# EasyEDA schematic SCH_Controlador-de-Voo_2026-04-27.json
TITLE: Placa Controladora de Voo com Arduino Nano; REV: 1.0; Date: 2026-04-27; Sheet: 1/1; Company: Eliezer Carvalho
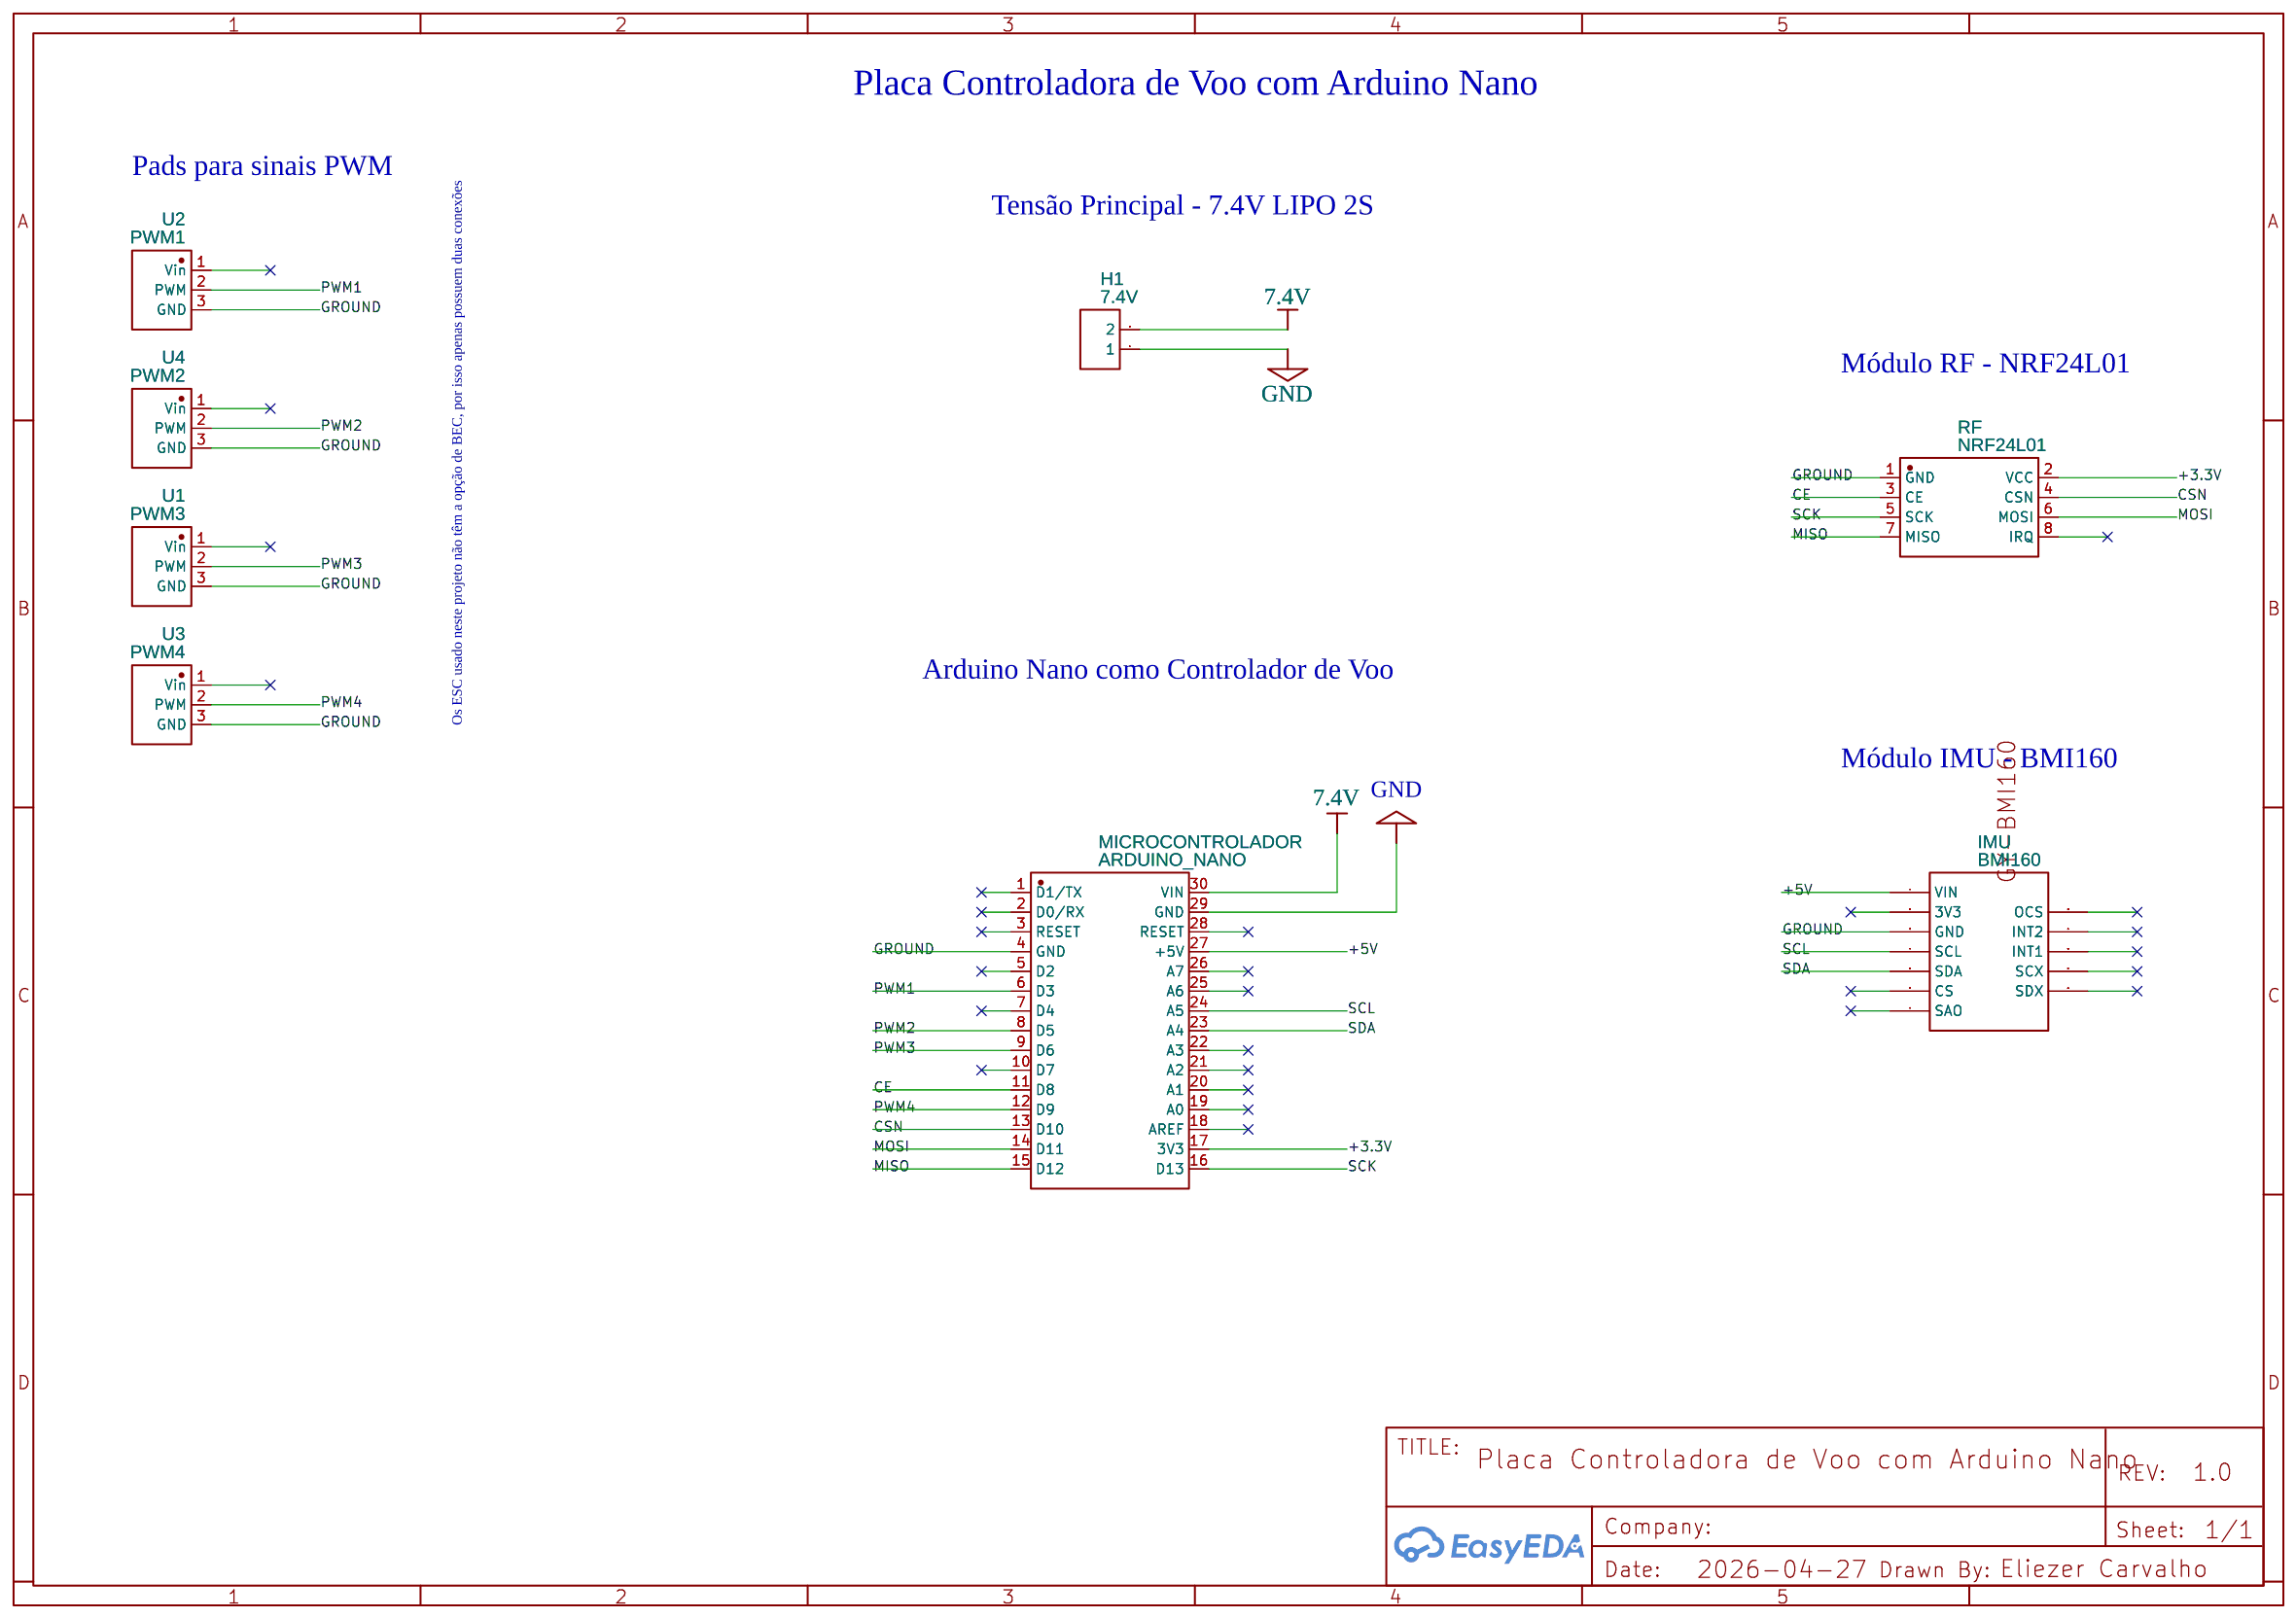
[diagram p0: schematic sheet]

## Parts
H1  7.4V  [HDR-F-2.54_1X2]
IMU  BMI160  [BMI160-BREAKOUT]
MICROCONTROLADOR  ARDUINO_NANO  [COMM-TH_ARDUINO_NANO]
RF  NRF24L01  [COMM-TH_L41.0-W15.5-P2.54_NRF24L01]
U1  PWM3  [PWM-CONTROLLER]
U2  PWM1  [PWM-CONTROLLER]
U3  PWM4  [PWM-CONTROLLER]
U4  PWM2  [PWM-CONTROLLER]

## Library data of the parts
H1 = HDR-F-2.54_1x2: Supplier Part: C49661; Supplier: LCSC; Contributor: LCEDA_Lib
IMU = BMI160 COPY: Contributor: crying_cat
MICROCONTROLADOR = ARDUINO_NANO: Contributor: lcsc; Supplier: LCSC; Supplier Part: C9900017879; Manufacturer: null; JLCPCB Part Class: Extended Part
RF = NRF24L01+PA+LNA: Supplier: LCSC; Supplier Part: C9900187674; Manufacturer: null; Manufacturer Part: nRF24L01+PA+LNA; JLCPCB Part Class: Extended Part; Contributor: lcsc
U1-U4 = PWM-Controller: Contributor: wruotolo

## Nets
7.4V: H1.2 MICROCONTROLADOR.30(VIN)
+3.3V: MICROCONTROLADOR.17(3V3) RF.2(VCC)
+5V: IMU.7(VIN) MICROCONTROLADOR.27(+5V)
GND: H1.1 MICROCONTROLADOR.29(GND)
CE: MICROCONTROLADOR.11(D8) RF.3(CE)
CSN: MICROCONTROLADOR.13(D10) RF.4(CSN)
GROUND: IMU.5(GND) MICROCONTROLADOR.4(GND) RF.1(GND) U1.3(GND) U2.3(GND) U3.3(GND) U4.3(GND)
MISO: MICROCONTROLADOR.15(D12) RF.7(MISO)
MOSI: MICROCONTROLADOR.14(D11) RF.6(MOSI)
PWM1: MICROCONTROLADOR.6(D3) U2.2(PWM)
PWM2: MICROCONTROLADOR.8(D5) U4.2(PWM)
PWM3: MICROCONTROLADOR.9(D6) U1.2(PWM)
PWM4: MICROCONTROLADOR.12(D9) U3.2(PWM)
SCK: MICROCONTROLADOR.16(D13) RF.5(SCK)
SCL: IMU.4(SCL) MICROCONTROLADOR.24(A5)
SDA: IMU.3(SDA) MICROCONTROLADOR.23(A4)

Not connected (* = marked no-connect by the designer): IMU 1(SAO) 2(CS) 6(3V3) 8(OCS) 9(INT2) 10(INT1) 11(SCX) 12(SDX); MICROCONTROLADOR 1(D1/TX) 2(D0/RX) 3(RESET) 5(D2) 7(D4) 10(D7) 18(AREF) 19(A0) 20(A1) 21(A2) 22(A3) 25(A6) 26(A7) 28(RESET); RF 8(IRQ); U1 1(Vin); U2 1(Vin); U3 1(Vin); U4 1(Vin)

## Notes on the sheet
- Placa Controladora de Voo com Arduino Nano
- Pads para sinais PWM
- Tensão Principal - 7.4V LIPO 2S
- Módulo RF - NRF24L01
- Arduino Nano como Controlador de Voo
- Os ESC usado neste projeto não têm a opção de BEC, por isso apenas possuem duas conexões
- Módulo IMU - BMI160
